# EAGLE design meaga relay v2 (EAGLE 9.6.2)
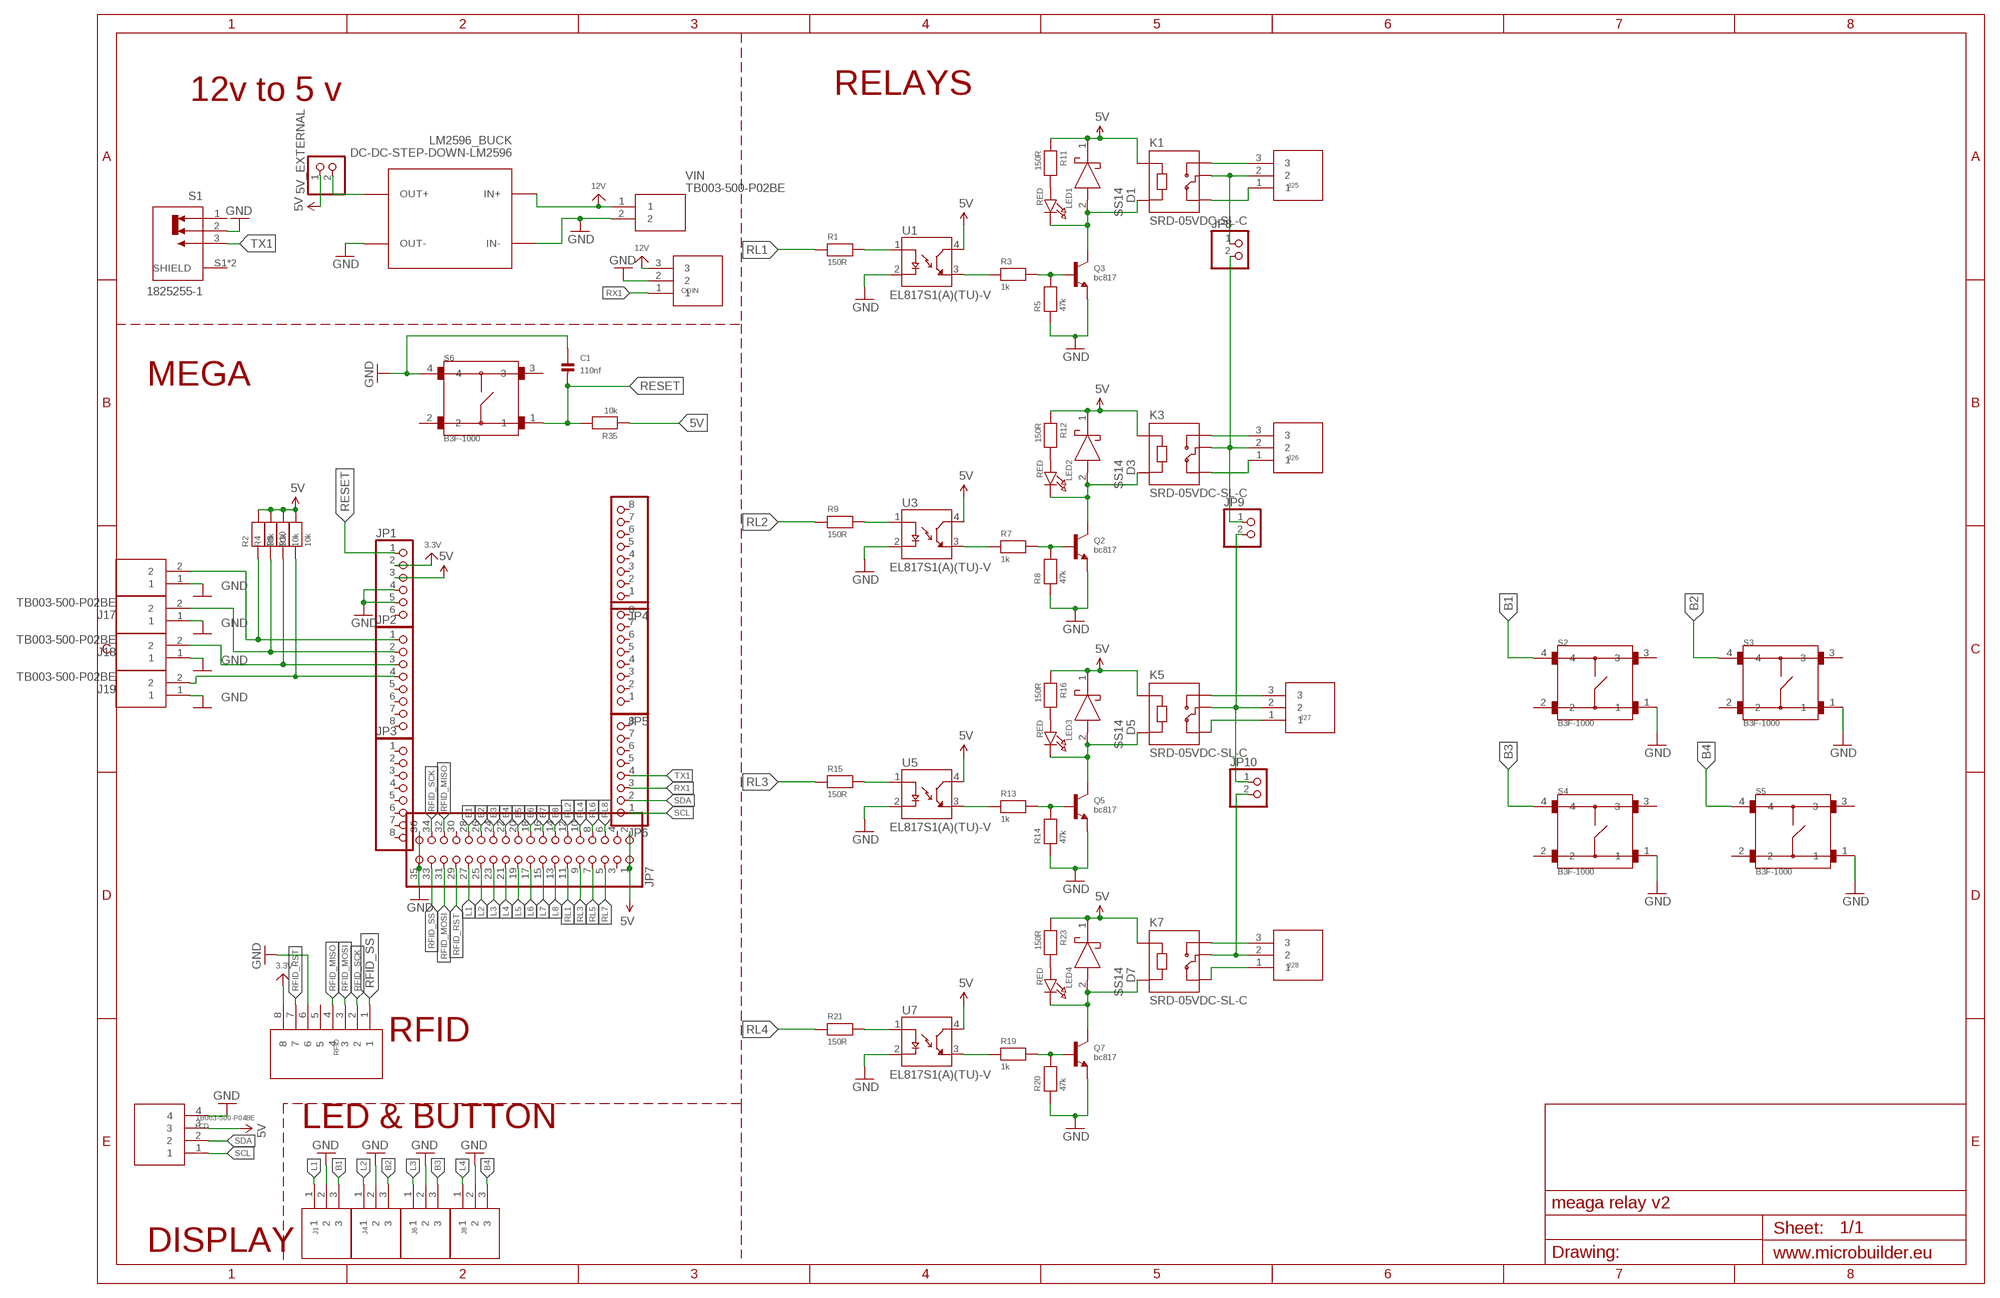
[diagram p0: schematic, sheet 1]

## Parts
5V_EXTERNAL  HEADER-1X2ROUND  [1X02_ROUND]
C1  110nf  CAP_CERAMIC0603  [0603]
COIN  TB003-500-P03BE  [CUI_TB003-500-P03BE]
D1  SS14  [DIOM5227X270N]
D3  SS14  [DIOM5227X270N]
D5  SS14  [DIOM5227X270N]
D7  SS14  [DIOM5227X270N]
J1  TB003-500-P03BE  [CUI_TB003-500-P03BE]
J4  TB003-500-P03BE  [CUI_TB003-500-P03BE]
J6  TB003-500-P03BE  [CUI_TB003-500-P03BE]
J8  TB003-500-P03BE  [CUI_TB003-500-P03BE]
J17  TB003-500-P02BE  [CUI_TB003-500-P02BE]
J18  TB003-500-P02BE  [CUI_TB003-500-P02BE]
J19  TB003-500-P02BE  [CUI_TB003-500-P02BE]
J20  TB003-500-P02BE  [CUI_TB003-500-P02BE]
J25  TB003-500-P03BE  [CUI_TB003-500-P03BE]
J26  TB003-500-P03BE  [CUI_TB003-500-P03BE]
J27  TB003-500-P03BE  [CUI_TB003-500-P03BE]
J28  TB003-500-P03BE  [CUI_TB003-500-P03BE]
JP1  PINHD-1X6  [1X06]
JP2  PINHD-1X8  [1X08]
JP3  PINHD-1X8  [1X08]
JP4  PINHD-1X8  [1X08]
JP5  PINHD-1X8  [1X08]
JP6  PINHD-1X8  [1X08]
JP7  PINHD-2X18  [2X18]
JP8  HEADER-1X2ROUND  [1X02_ROUND]
JP9  HEADER-1X2ROUND  [1X02_ROUND]
JP10  HEADER-1X2ROUND  [1X02_ROUND]
K1  SRD-05VDC-SL-C  [RELAY_SRD-05VDC-SL-C]
K3  SRD-05VDC-SL-C  [RELAY_SRD-05VDC-SL-C]
K5  SRD-05VDC-SL-C  [RELAY_SRD-05VDC-SL-C]
K7  SRD-05VDC-SL-C  [RELAY_SRD-05VDC-SL-C]
LCD  TB003-500-P04BE  [CUI_TB003-500-P04BE]
LED1  RED  LED0603  [CHIPLED_0603]
LED2  RED  LED0603  [CHIPLED_0603]
LED3  RED  LED0603  [CHIPLED_0603]
LED4  RED  LED0603  [CHIPLED_0603]
LM2596_BUCK  DC-DC-STEP-DOWN-LM2596  [DC-DC-STEP-DOWN-LM2596]
Q2  bc817  TRANSISTOR_NPN  [SOT23-R]
Q3  bc817  TRANSISTOR_NPN  [SOT23-R]
Q5  bc817  TRANSISTOR_NPN  [SOT23-R]
Q7  bc817  TRANSISTOR_NPN  [SOT23-R]
R1  150R  RESISTOR0603  [0603]
R2  10k  RESISTOR0603  [0603]
R3  1k  RESISTOR0603  [0603]
R4  10k  RESISTOR0603  [0603]
R5  47k  RESISTOR0603  [0603]
R6  10k  RESISTOR0603  [0603]
R7  1k  RESISTOR0603  [0603]
R8  47k  RESISTOR0603  [0603]
R9  150R  RESISTOR0603  [0603]
R10  10k  RESISTOR0603  [0603]
R11  150R  RESISTOR0402  [0402]
R12  150R  RESISTOR0402  [0402]
R13  1k  RESISTOR0603  [0603]
R14  47k  RESISTOR0603  [0603]
R15  150R  RESISTOR0603  [0603]
R16  150R  RESISTOR0402  [0402]
R19  1k  RESISTOR0603  [0603]
R20  47k  RESISTOR0603  [0603]
R21  150R  RESISTOR0603  [0603]
R23  150R  RESISTOR0402  [0402]
R35  10k  RESISTOR0402  [0402]
RFID  TB003-500-P08BE  [CUI_TB003-500-P08BE]
S1  1825255-1  [SW_1825255-1]
S2  B3F-1000  [SW_B3F-1000]
S3  B3F-1000  [SW_B3F-1000]
S4  B3F-1000  [SW_B3F-1000]
S5  B3F-1000  [SW_B3F-1000]
S6  B3F-1000  [SW_B3F-1000]
U1  EL817S1(A)(TU)-V  [SOIC254P1030X390-4N_EL817S1(A)(TU)-V]
U3  EL817S1(A)(TU)-V  [SOIC254P1030X390-4N_EL817S1(A)(TU)-V]
U5  EL817S1(A)(TU)-V  [SOIC254P1030X390-4N_EL817S1(A)(TU)-V]
U7  EL817S1(A)(TU)-V  [SOIC254P1030X390-4N_EL817S1(A)(TU)-V]
VIN  TB003-500-P02BE  [CUI_TB003-500-P02BE]

## Nets
3.3V: JP1.2 RFID.8
5V: 5V_EXTERNAL.1 D1.1(K) D3.1(K) D5.1(K) D7.1(K) JP1.3 JP7.1 JP7.2 K1.A1 K3.A1 K5.A1 K7.A1 LCD.3 R2.2 R4.2 R6.2 R10.2 R11.1 R12.1 R16.1 R23.1 R35.1 U1.4(CT) U3.4(CT) U5.4(CT) U7.4(CT)
12V: COIN.3 LM2596_BUCK.IN+ VIN.1
B1: J1.3 JP7.28 S2.4
B2: J4.3 JP7.26 S3.4
B3: J6.3 JP7.24 S4.4
B4: J8.3 JP7.22 S5.4
B5: JP7.20
B6: JP7.18
B7: JP7.16
B8: JP7.14
GND: C1.1 COIN.2 J1.2 J4.2 J6.2 J8.2 J17.1 J18.1 J19.1 J20.1 JP1.4 JP1.5 JP7.35 JP7.36 LCD.4 LM2596_BUCK.IN- LM2596_BUCK.OUT- Q2.2(E) Q3.2(E) Q5.2(E) Q7.2(E) R5.1 R8.1 R14.1 R20.1 RFID.6 S1.2 S2.1 S3.1 S4.1 S5.1 S6.4 U1.2(C) U3.2(C) U5.2(C) U7.2(C) VIN.2
L1: J1.1 JP7.27
L2: J4.1 JP7.25
L3: J6.1 JP7.23
L4: J8.1 JP7.21
L5: JP7.19
L6: JP7.17
L7: JP7.15
L8: JP7.13
N$1: R3.1 U1.3(ET)
N$2: R1.2 U1.1(A)
N$3: J25.1 K1.NC
N$4: J17.2 JP2.1 R2.1
N$5: J18.2 JP2.2 R4.1
N$6: J19.2 JP2.3 R6.1
N$7: J20.2 JP2.4 R10.1
N$8: 5V_EXTERNAL.2 LM2596_BUCK.OUT+
N$9: D1.2(A) K1.A2 LED1.C Q3.3(C)
N$10: LED1.A R11.2
N$11: D3.2(A) K3.A2 LED2.C Q2.3(C)
N$12: Q2.1(B) R7.2 R8.2
N$13: J26.3 K3.NO
N$14: R7.1 U3.3(ET)
N$15: Q3.1(B) R3.2 R5.2
N$16: R9.2 U3.1(A)
N$17: J26.1 K3.NC
N$18: J25.3 K1.NO
N$19: LED2.A R12.2
N$20: LED3.A R16.2
N$21: J27.1 K5.NC
N$22: J28.1 K7.NC
N$23: J25.2 JP8.1 K1.COM
N$24: J26.2 JP8.2 JP9.1 K3.COM
N$25: D5.2(A) K5.A2 LED3.C Q5.3(C)
N$26: Q5.1(B) R13.2 R14.2
N$27: J27.3 K5.NO
N$28: R13.1 U5.3(ET)
N$29: R15.2 U5.1(A)
N$30: LED4.A R23.2
N$35: J28.2 JP10.2 K7.COM
N$36: J27.2 JP9.2 JP10.1 K5.COM
N$37: D7.2(A) K7.A2 LED4.C Q7.3(C)
N$38: Q7.1(B) R19.2 R20.2
N$39: J28.3 K7.NO
N$40: R19.1 U7.3(ET)
N$41: R21.2 U7.1(A)
RESET: C1.2 JP1.1 R35.2 S6.1
RFID_MISO: JP7.32 RFID.4
RFID_MOSI: JP7.31 RFID.3
RFID_RST: JP7.29 RFID.7
RFID_SCK: JP7.34 RFID.2
RFID_SS: JP7.33 RFID.1
RL1: JP7.11 R1.1
RL2: JP7.12 R9.1
RL3: JP7.9 R15.1
RL4: JP7.10 R21.1
RL5: JP7.7
RL6: JP7.8
RL7: JP7.5
RL8: JP7.6
RX1: COIN.1 JP6.3
SCL: JP6.1 LCD.1
SDA: JP6.2 LCD.2
TX1: JP6.4 S1.3
Unconnected: JP1.6 JP2.5 JP2.6 JP2.7 JP2.8 JP3.1 JP3.2 JP3.3 JP3.4 JP3.5 JP3.6 JP3.7 JP3.8 JP4.1 JP4.2 JP4.3 JP4.4 JP4.5 JP4.6 JP4.7 JP4.8 JP5.1 JP5.2 JP5.3 JP5.4 JP5.5 JP5.6 JP5.7 JP5.8 JP6.5 JP6.6 JP6.7 JP6.8 JP7.3 JP7.4 JP7.30 RFID.5 S1.1 S1.S1(SHIELD) S1.S2(SHIELD) S2.2 S2.3 S3.2 S3.3 S4.2 S4.3 S5.2 S5.3 S6.2 S6.3

## Notes on the sheet
- 12v to 5 v | RELAYS
- MEGA
- RFID
- LED & BUTTON
- DISPLAY

## Library data of the parts
5V_EXTERNAL JP8-JP10 = microbuilder:HEADER-1X2: PIN HEADER
C1 = microbuilder:CAP_CERAMIC: Ceramic Capacitors 0402 - 0402 Surface Mount Capacitors 16pF 50V 5% [Digikey: 445-4899-2-ND] 18pF 50V 5% [Digikey: 490-1281-2-ND] 22pF 50V 5% [Digikey: 490-1283-2-ND] 68pF 50V 5% [Digikey: 490-1289-2-ND] 0.1uF 10V 10% [Digikey: 490-1318-2-ND] 1.0uF 6.3V 10% [Digikey: 490-1320-2-ND] 0603 - 0603 Surface Mount Capacitors 16 pF 50V 5% [Digikey: 445-5051-2-ND] 22 pF 50V [Digikey: PCC220ACVTR-ND] 33 pF 50V 5% [Digikey: 490-1415-1-ND] 56pF 50V 5% [Digikey: 490-1421-1-ND] 220pF 50V 5% [Digikey: 445-1285-1-ND] 680 pF 50V 2200 pF 50V 5% C0G [Digikey: 445-1297-1-ND] 5600 pF 100V 5% X7R [Digikey: 478-3711-1-ND] 0.1 µF 25V 10% [Digikey: PCC2277TR-ND] 0.22 µF 16V 10% X7R [Digikey: 445-1318-1-ND] 1.0 µF 25V 10% [Digikey: 445-5146-2-ND] 0603 - RF Specific 3pF 250V +/-0.1pF RF [Digikey: 712-1347-1-ND] 18 pF 250V 5% [Digikey: 478-3505-1-ND or 712-1322-1-ND] 56 pF 250V 5% C0G RF [Digikey: 490-4867-1-ND] 68 pF 250V RF [Digikey: 490-4868-1-ND] 0805 - 0805 Surface Mount Capacitors 220 pF 250V 2% RF Ceramic Capacitor [Digikey: 712-1398-1-ND] 1000 pF 50V 2% NP0 Ceramic Capacitor [Digikey: 478-3760-1-ND] 0.1 µF 25V 10% Ceramic Capacitor [Digikey: PCC1828TR-ND] 1.0 µF 16V 10% Ceramic Capacitor[Digikey: 490-1691-2-ND] 10.0 µF 10V 10% Ceramic Capacitor[Digikey: 709-1228-1-ND] 10.0 uF 16V 10% Ceramic Capacitor [Digikey: 478-5165-2-ND] 47 uF 6.3V 20% Ceramic Capacitor [Digikey: 587-1779-1-ND or 399-5506-1-ND] 1206 - 1206 Surface Mount Capacitors 47uF 10V 20% Ceramic Capacitor [Digikey: 490-5528-1-ND or 399-5508-1-ND or 445-6010-1-ND] 100uF 6.3V -20%, +80% Y5V Ceramic Capacitor (Digikey: 490-4512-1-ND, Mouser: 81-GRM31CF50J107ZE1L)
COIN J1 J4 J6 J8 J25-J28 = TB003-500-P03BE:TB003-500-P03BE: Check prices <https://pricing.snapeda.com/parts/TB003-500-P03BE/CUI%20Devices/view-part?ref=eda>; AVAILABILITY: Good; CUI_PURCHASE_URL: https://www.cuidevices.com/product/interconnect/connectors/terminal-blocks/tb003-500-series?utm_source=snapeda.com&utm_medium=referral&utm_campaign=snapedaBOM; DESCRIPTION: 2~24 Poles, Screw Type, Horizontal, 5.0 Pitch, 26~14 (AWG), Terminal Block Connector; MF: CUI Devices; MP: TB003-500-P03BE; PACKAGE: None; PRICE: None; PURCHASE-URL: https://pricing.snapeda.com/search/part/TB003-500-P03BE/?ref=eda
D1 D3 D5 D7 = SS14:SS14: 1.0 A Schottky Barrier Rectifiers Source: Datasheet <http://www.onsemi.com/pub/Collateral/SS19-D.pdf>; DESCRIPTION: 1.0 A Schottky Barrier Rectifiers; HEIGHT: 2.7mm; MANUFACTURER_NAME: ON Semiconductor; MANUFACTURER_PART_NUMBER: SS14; MOUSER_PART_NUMBER: 512-SS14; MOUSER_PRICE-STOCK: https://www.mouser.com/Search/Refine.aspx?Keyword=512-SS14; RS_PART_NUMBER: 7390467P; RS_PRICE-STOCK: http://uk.rs-online.com/web/p/products/7390467P
J17-J20 VIN = TB003-500-P02BE:TB003-500-P02BE: Check prices <https://pricing.snapeda.com/parts/TB003-500-P02BE/CUI%20Devices/view-part?ref=eda>; AVAILABILITY: Good; CUI_PURCHASE_URL: https://www.cuidevices.com/product/interconnect/connectors/terminal-blocks/tb003-500-series?utm_source=snapeda.com&utm_medium=referral&utm_campaign=snapedaBOM; DESCRIPTION: 2~24 Poles, Screw Type, Horizontal, 5.0 Pitch, 26~14 (AWG), Terminal Block Connector; MF: CUI Devices; MP: TB003-500-P02BE; PACKAGE: None; PRICE: None; PURCHASE-URL: https://pricing.snapeda.com/search/part/TB003-500-P02BE/?ref=eda
JP1 = pinhead:PINHD-1X6: PIN HEADER
JP2-JP6 = pinhead:PINHD-1X8: PIN HEADER
JP7 = pinhead:PINHD-2X18: PIN HEADER
K1 K3 K5 K7 = SRD-05VDC-SL-C:SRD-05VDC-SL-C: 5V Trigger Relay Module For Arduino And Raspberry Pi 5V Trigger Relay Module For Arduino And Raspberry Pi; AVAILABILITY: Unavailable; DESCRIPTION: 5V Trigger Relay Module For Arduino And Raspberry Pi 5V Trigger Relay Module For Arduino And Raspberry Pi; MF: Songle Relay; MP: SRD-05VDC-SL-C; PACKAGE: None; PRICE: None
LCD = TB003-500-P04BE:TB003-500-P04BE: Check prices <https://pricing.snapeda.com/parts/TB003-500-P04BE/CUI%20Devices/view-part?ref=eda>; AVAILABILITY: Good; CUI_PURCHASE_URL: https://www.cuidevices.com/product/interconnect/connectors/terminal-blocks/tb003-500-series?utm_source=snapeda.com&utm_medium=referral&utm_campaign=snapedaBOM; DESCRIPTION: 2~24 Poles, Screw Type, Horizontal, 5.0 Pitch, 26~14 (AWG), Terminal Block Connector; MF: CUI Devices; MP: TB003-500-P04BE; PACKAGE: None; PRICE: None; PURCHASE-URL: https://pricing.snapeda.com/search/part/TB003-500-P04BE/?ref=eda
LED1-LED4 = microbuilder:LED: LED 0603 - 0603 Surface Mount Package 2mA: Green LED - Low Power (3.9mcd, 2ma, 1.7Vf) - Digikey: 475-2709-2-ND Orange LED - Low Power (9.8mcd, 2ma, 1.8Vf) - Digikey: 475-1194-2-ND Red LED - Low Power (5mcd, 2ma, 1.8Vf) - Digikey: 475-1195-2-ND Yellow LED - Low Power (7mcd, 2ma, 1.8Vf) - Digikey: 475-1196-2-ND 5mA: Blue LED - Low Power (17mcd, 5ma, 2.9Vf) - Digikey: LNJ937W8CRACT-ND 0805 - 0805 Surface Mount Package 2mA: Red LED (8.8mcd, 2mA, 1.8Vf, Clear) - Low Power [Digikey: 475-2510-1-ND] Green LED (5mcd, 2mA, 1.8Vf, Clear) - Low Power [Digikey: 475-2730-1-ND] Yellow LED (11.3mcd, 2mA, 1.8Vf, Clear) - Low Power [Digikey: 475-2555-1-ND] 20mA: Red LED (104mcd, 20mA, Diffused) - LS R976 [Digikey: 475-1278-6-ND] Red LED (12mcd, 20mA, 2.0Vf, Clear) - APT2012EC [Digikey: 754-1128-1-ND] Green LED (15mcd, 20mA, 2.2Vf, Clear) - APT2012GC [Digikey: 754-1131-1-ND] Orange LED (160mcd, 20mA, 2.1Vf, Clear) - APT2012SECK [Digikey: 754-1130-1-ND] 1206 - 1206 Surface Mount Package Green LED (26mcd, 20mA, Diffused) - LG N971 [Digikey: 475-1407-6-ND] Red LED (15mcd, 20mA, Diffused) - LH N974 [Digikey: 475-1416-6-ND]
LM2596_BUCK = diy-modules:DC-DC-STEP-DOWN-LM2596: DC/DC Step-Down Regulator based on LM2596-ADJ chip LM2596 datasheet available here: http://www.ti.com/lit/ds/symlink/lm2596.pdf Click here to find device on ebay.com <http://www.ebay.com/sch/lm2596+power+regulator>
Q2 Q3 Q5 Q7 = microbuilder:TRANSISTOR_NPN: NPN Transistor Transistor (NPN) 500mA 45V - BC817 [Digikey: 568-1631-1-ND] Transistor (NPN) 500mA 45V - BC817,215 [Mouser: 771-BC817-T/R] SOT23-R - SOT23 footprint optimised for use with solder paste and reflow ovens. SOT23-W - SOT23 footprint optimised for hand-soldering (larger pads).
R1-R16 R19-R21 R23 R35 = microbuilder:RESISTOR: Resistors 0402 - 0402 Surface Mount Package 22 Ohm 1% 1/16W [Digikey: 311-22.0LRTR-ND] 33 Ohm 5% 1/16W 1.0K 5% 1/16W 1.5K 5% 1/16W 2.0K 1% 1/16W 10.0K 1% 1/16W [Digikey: 311-10.0KLRTR-ND] 10.0K 5% 1/16W [Digikey: RMCF0402JT10K0TR-ND] 12.1K 1% 1/16W [Digikey: 311-22.0LRTR-ND] 100.0K 5% 1/16W 0603 - 0603 Surface Mount Package 0 Ohm 1/10 Watt 1% Resistor 15 Ohm 1/10 Watt 1% Resistor 33 Ohm 1/10 Watt 1% Resistor 49.9 Ohm 1/10 Watt 1% Resistor 100 Ohm 1/10 Watt 1% Resistor 150 Ohm 1/10 Watt 1% Resistor 240 Ohm 1/10 Watt 1% Resistor 390 Ohm 1/10 Watt 1% Resistor 560 Ohm 1/10 Watt 1% Resistor 680 Ohm 1/10 Watt 1% Resistor 750 Ohm 1/10 Watt 1% Resistor 1.0K Ohm 1/10 Watt 1% Resistor 1.5K Ohm 1/10 Watt 1% Resistor 2.0K Ohm 1/10 Watt 1% Resistor 2.2K Ohm 1/10 Watt 1% Resistor 3.3K Ohm 1/10 Watt 1% Resistor 4.7K Ohm 1/10 Watt 1% Resistor 10.0K Ohm 1/10 Watt 1% Resistor 12.0K Ohm 1/10 Watt 1% Resistor 12.1K Ohm 1/10 Watt 1% Resistor 20.0K Ohm 1/10 Watt 1% Resistor 33.0K Ohm 1/10 Watt 1% Resistor 100.0K Ohm 1/10 Watt 1% Resistor 0805 - 0805 Surface Mount Package 0 Ohm 1/8 Watt 1% Resistor 33 Ohm 1/8 Watt 1% Resistor 100 Ohm 1/8 Watt 1% Resistor 150 Ohm 1/8 Watt 1% Resistor 200 Ohm 1/8 Watt 1% Resistor 240 Ohm 1/8 Watt 1% Resistor 330 Ohm 1/8 Watt 1% Resistor 390 Ohm 1/8 Watt 1% Resistor 470 Ohm 1/8 Watt 1% Resistor 1.0K Ohm 1/8 Watt 1% Resistor 1.5K Ohm 1/8 Watt 1% Resistor 2.0K Ohm 1/8 Watt 1% Resistor 4.7K Ohm 1/8 Watt 1% Resistor 5.1K Ohm 1/8 Watt 1% Resistor 5.6K Ohm 1/8 Watt 1% Resistor 10.0K Ohm 1/8 Watt 1% Resistor 22.0K Ohm 1/8 Watt 1% Resistor 33.0K Ohm 1/8 Watt 1% Resistor 100K Ohm 1/8 Watt 1% Resistor 1206 - 1206 Surface Mount Package 2012 - 2010 Surface Mount Package 0.11 Ohm 1/2 Watt 1% Resistor - Digikey: RHM.11UCT-ND
RFID = TB003-500-P08BE:TB003-500-P08BE: Check prices <https://pricing.snapeda.com/parts/TB003-500-P08BE/CUI%20Devices/view-part?ref=eda>; AVAILABILITY: Good; CUI_PURCHASE_URL: https://www.cuidevices.com/product/interconnect/connectors/terminal-blocks/tb003-500-series?utm_source=snapeda.com&utm_medium=referral&utm_campaign=snapedaBOM; DESCRIPTION: 2~24 Poles, Screw Type, Horizontal, 5.0 Pitch, 26~14 (AWG), Terminal Block Connector; MF: CUI Devices; MP: TB003-500-P08BE; PACKAGE: None; PRICE: None; PURCHASE-URL: https://pricing.snapeda.com/search/part/TB003-500-P08BE/?ref=eda
S1 = 1825255-1:1825255-1: Switch Slide ON None ON SPDT Top Slide 0.3A 125VAC PC Pins Thru-Hole Tray; COMMENT: 1825255-1; DESCRIPTION: Switch Slide ON None ON SPDT Top Slide 0.3A 125VAC PC Pins Thru-Hole Tray; DIGI-KEY_PART_NUMBER: 450-1567-ND; MF: TE Connectivity; MP: 1825255-1; PACKAGE: Custom Package TE Connectivity; PURCHASE-URL: https://pricing.snapeda.com/search/part/1825255-1/?ref=eda
S2-S6 = B3F-1000:B3F-1000: Switch, FLUX TIGHT MECHANICAL KEYSwitch, , 50MA@24VDC, NO GROUND TERM., FLAT PLUNG Check prices <https://pricing.snapeda.com/parts/B3F-1000/Omron/view-part?ref=eda>; AVAILABILITY: Warning; DESCRIPTION: Tactile Switch SPST-NO Top Actuated Through Hole; MF: Omron; MP: B3F-1000; PACKAGE: None; PRICE: None; PURCHASE-URL: https://pricing.snapeda.com/search/part/B3F-1000/?ref=eda
U1 U3 U5 U7 = EL817S1_A__TU_-V:EL817S1(A)(TU)-V: Optoisoltr 5kv Transistor 4-Smd; DESCRIPTION: Optoisolator Transistor Output 5000Vrms 1 Channel 4-SMD; DIGI-KEY_PART_NUMBER: EL817S1(A)(TU)-V-ND; MF: Everlight Electronics; MP: EL817S1(A)(TU)-V; PACKAGE: SMD-4 Everlight Electronics Co Ltd

## Net classes
0 default: width 0.203 mm, drill 0.406 mm, clearance 0.203 mm

## Board
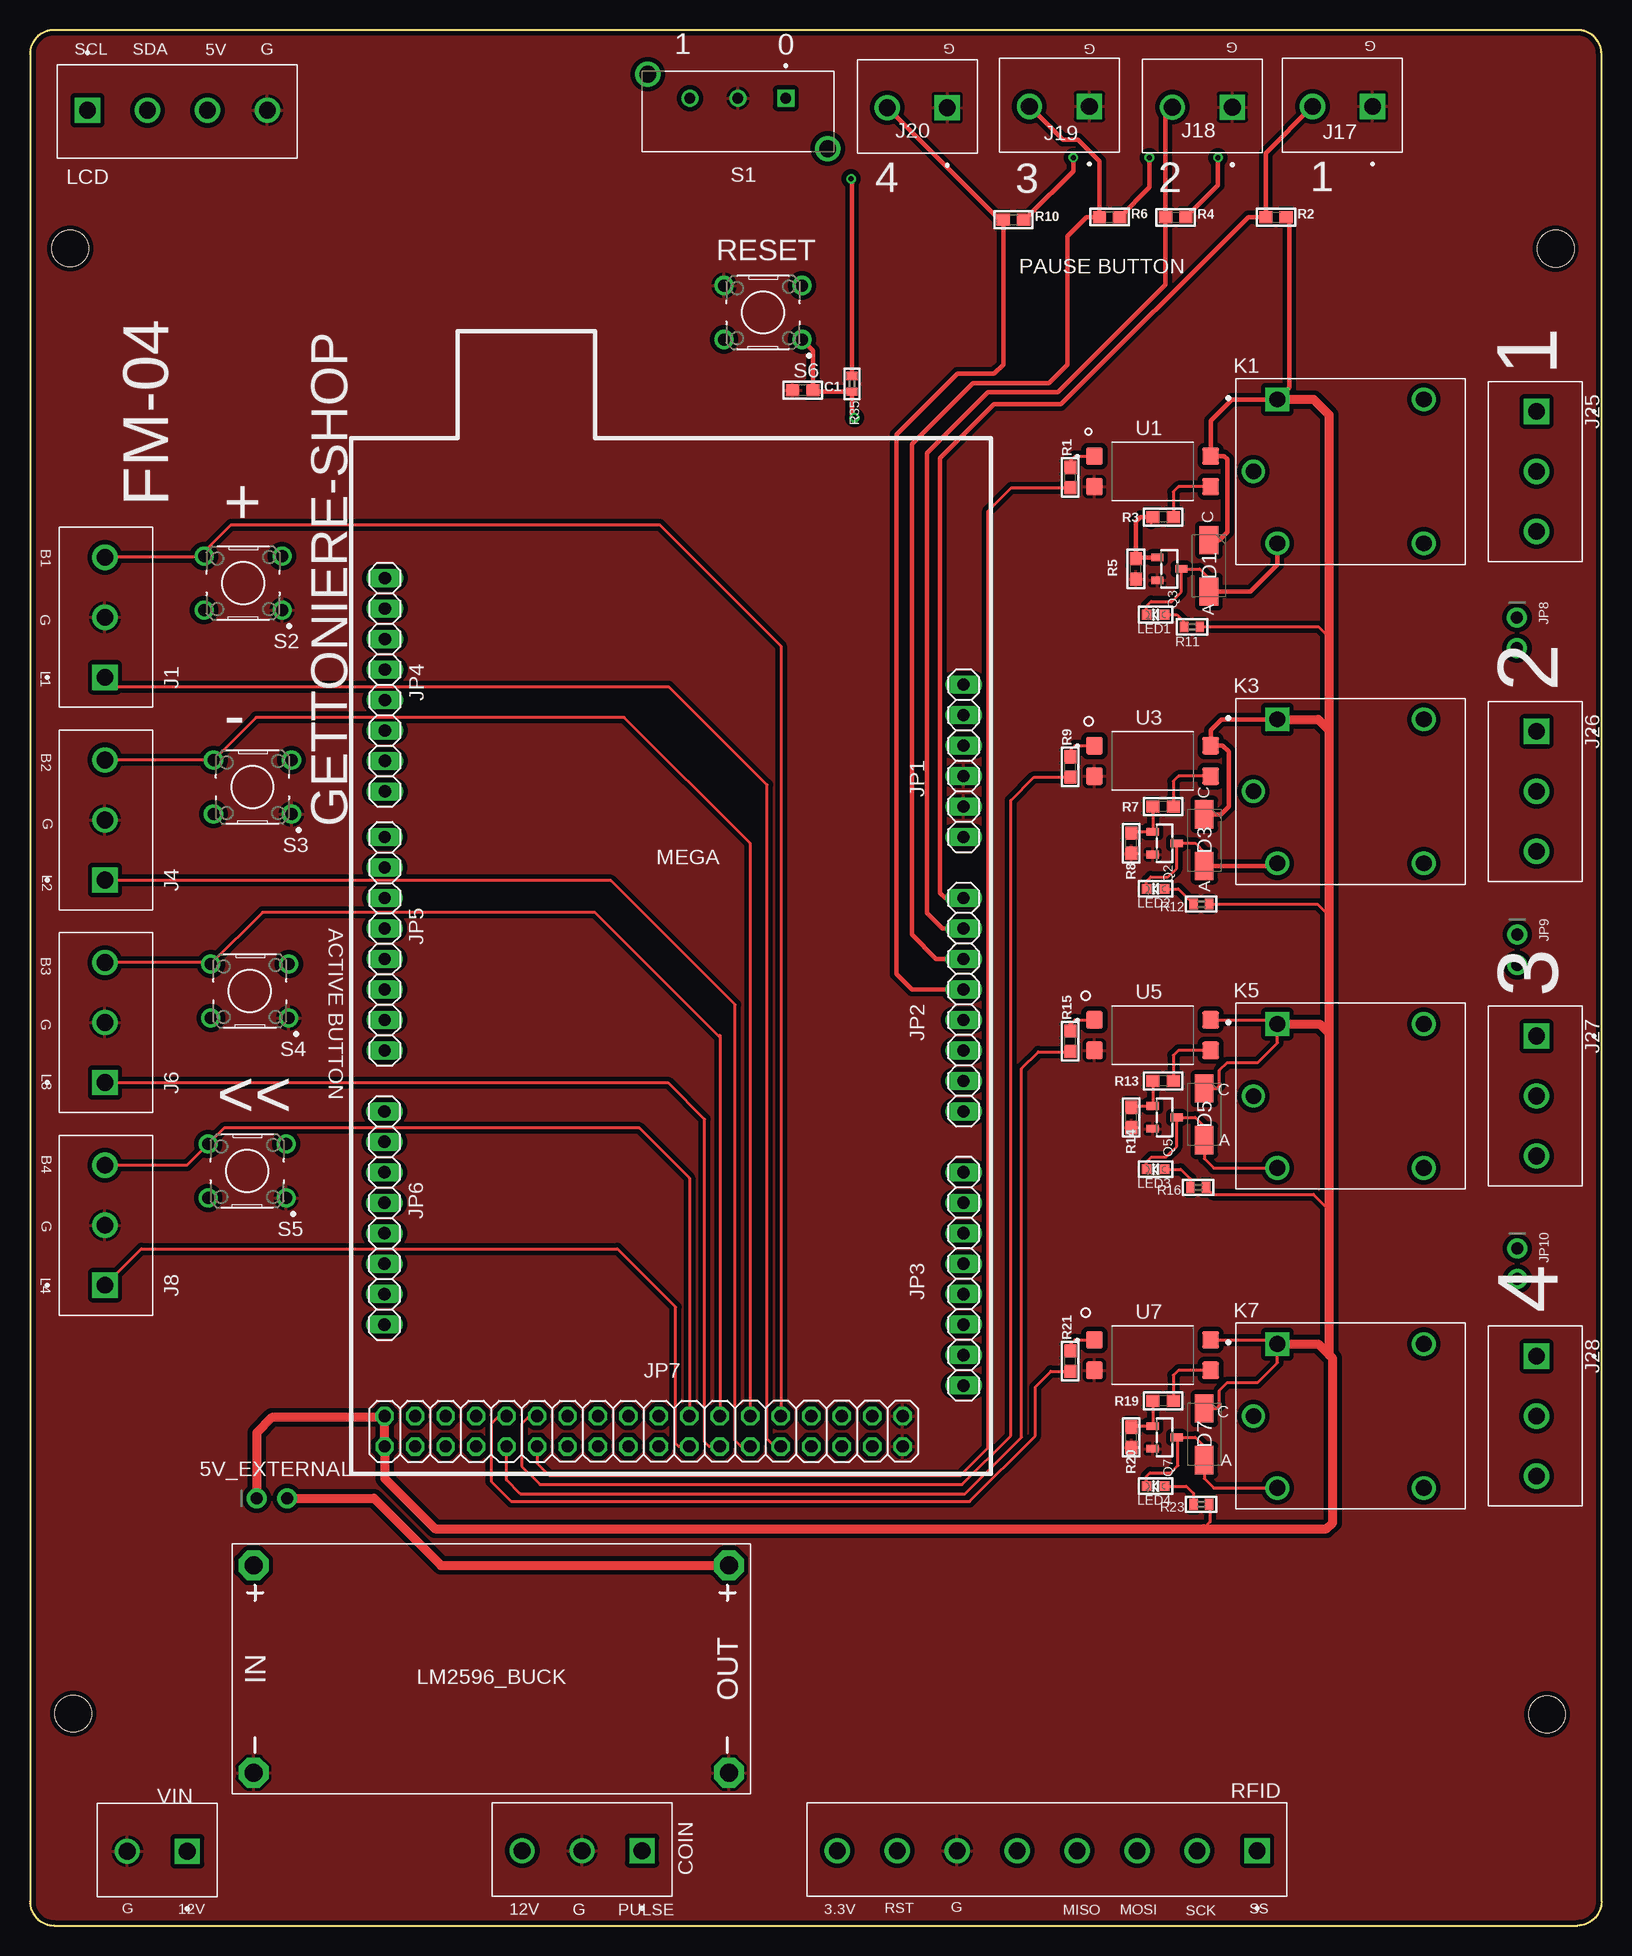
[diagram p1: board, top side]
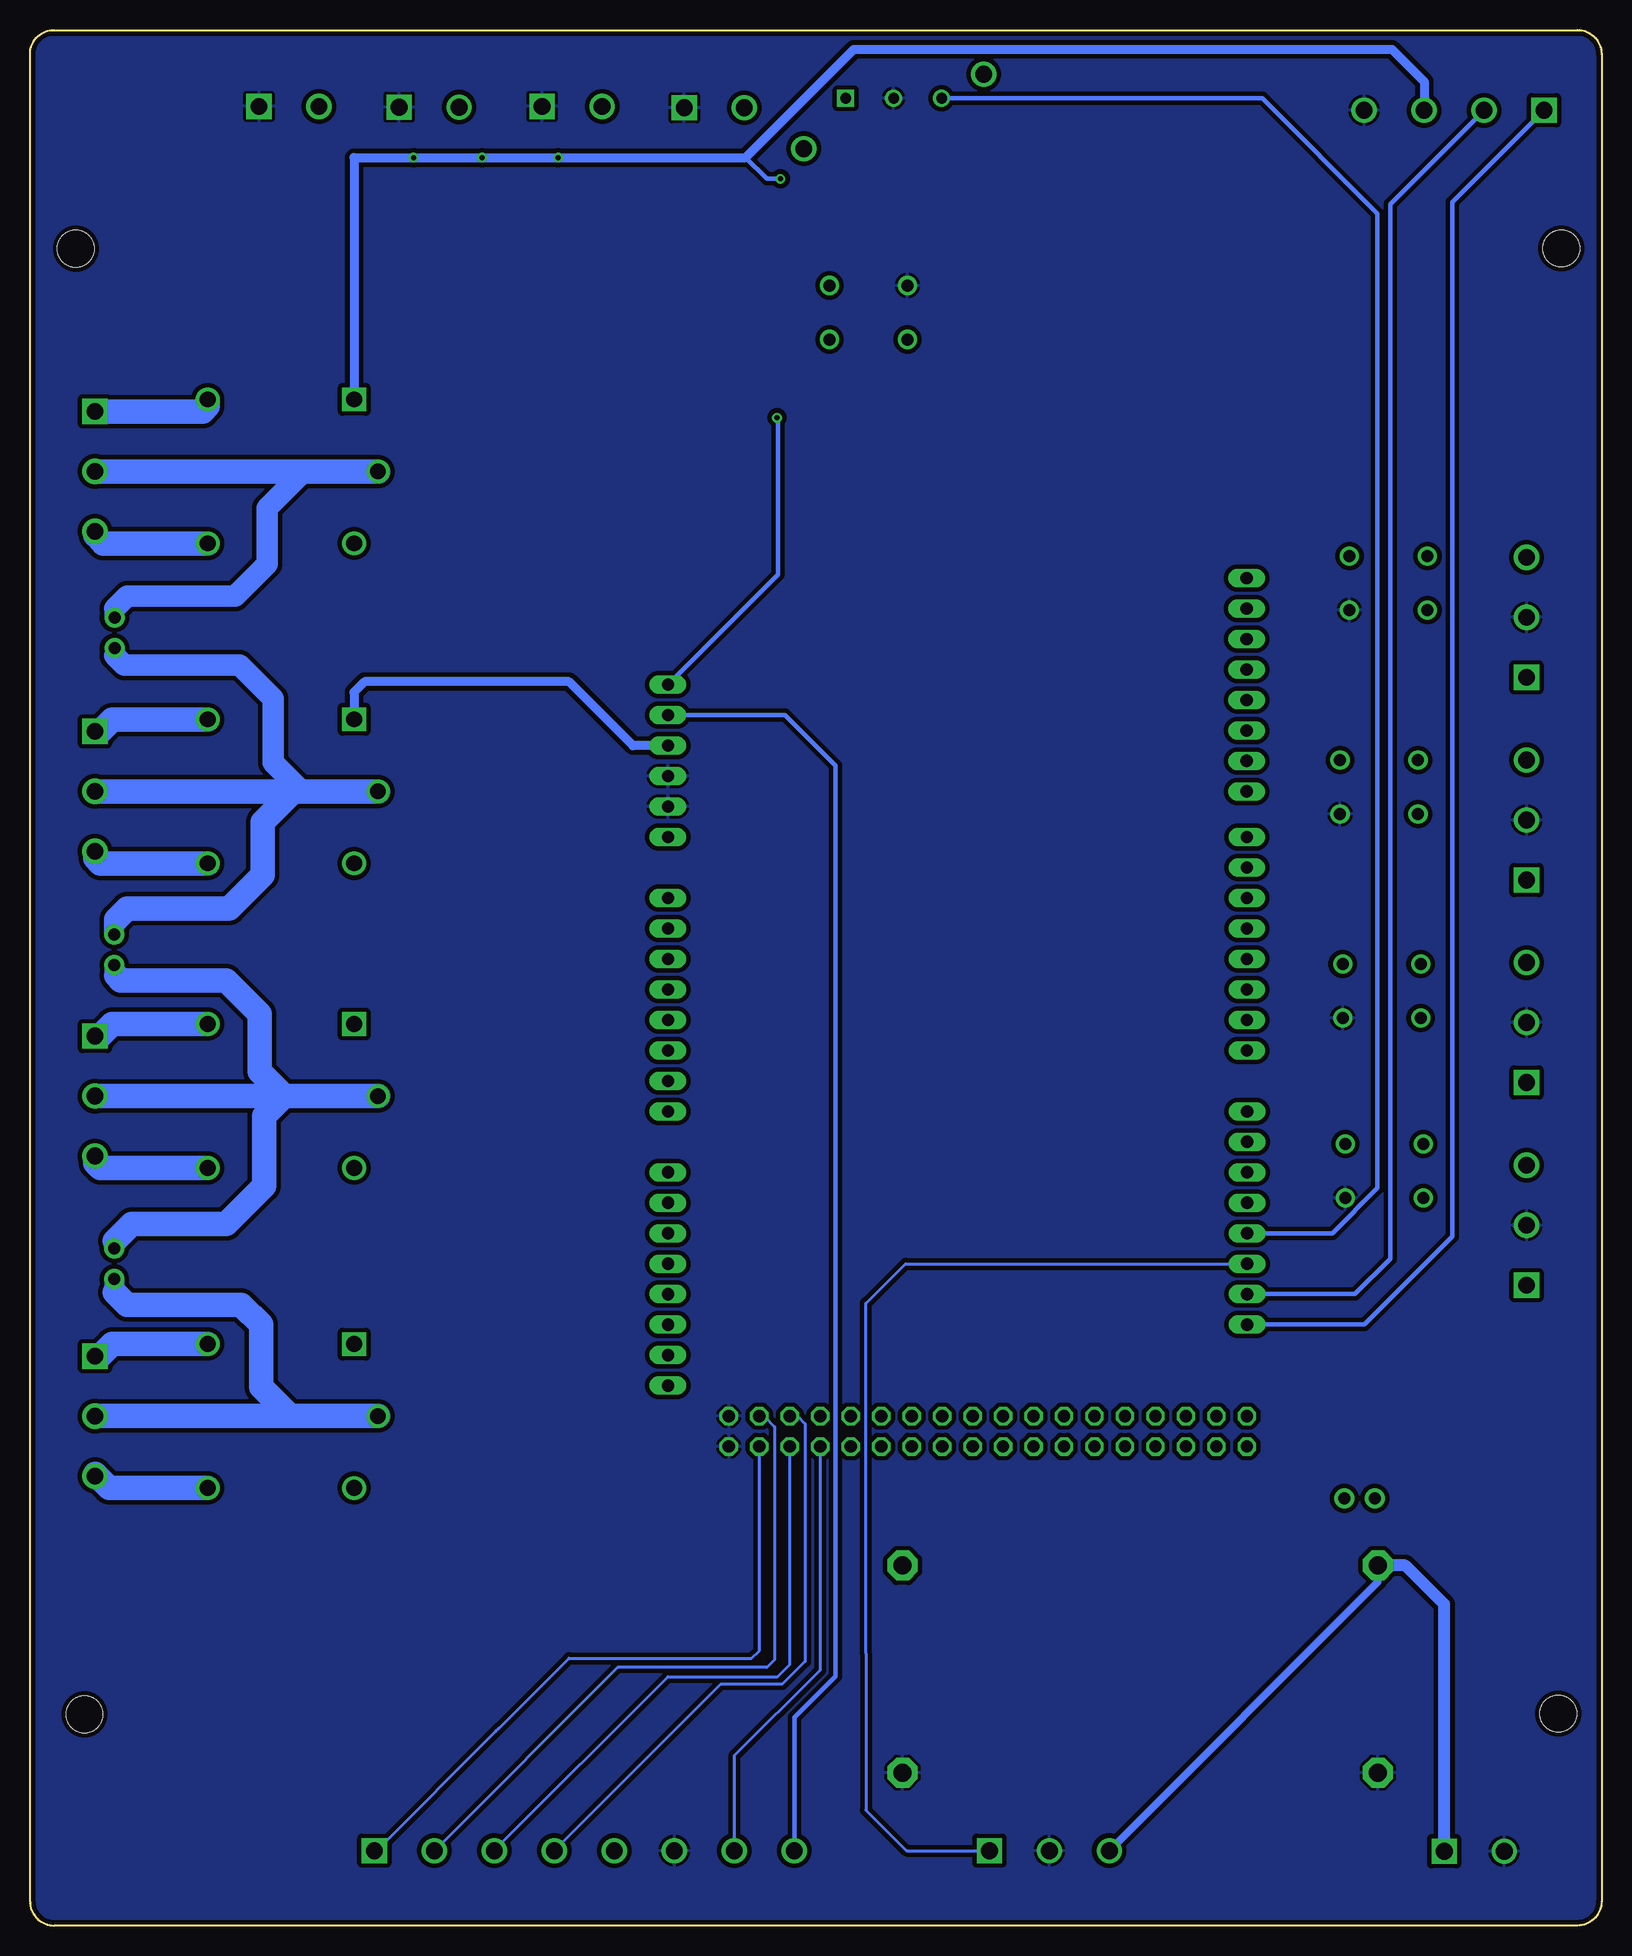
[diagram p2: board, bottom side, seen from below]

Size 131 x 158 mm. Coordinates in mm from the lower left corner, seen from the top.
Outline: 2,0 129,0 arc90 131,2 131,156 arc90 129,158 2,158 arc90 0,156 0,2 arc90 2,0
Copper layers (1*16): Top 0.035mm / dielectric 1.5mm / Bottom 0.035mm
Design rules "default *": minimum track width 6mil, minimum drill 0.3mm, track to track 6mil, track to pad 6mil, pad to pad 6mil, via to via 6mil, smd to smd 6mil, copper to edge 10mil, drill to drill 6mil, minimum pad ring 10mil, minimum via ring 8mil, stop-mask expansion 4mil, vias tented up to drill 20mil, thermal gap 10mil
Holes 3.05 mm at 126.47,17.6 127.18,139.77 3.36,139.79 3.61,17.68

### Footprints (pad centres in the part's own frame; a part is rotated, then mirrored left to right if it is on the bottom)
1X02_ROUND = drill 1 pad 1.676: 1 -1.27,0; 2 1.27,0
0603 = smd 1.1 x 1: 1 -0.85,0; 2 0.85,0
CUI_TB003-500-P03BE = drill 1.4 square: 1 0,0 | drill 1.4: 2 5,0; 3 10,0
DIOM5227X270N = smd 2.35 x 1.55: 1 -2.15,0; 2 2.15,0
CUI_TB003-500-P02BE = drill 1.4 square: 1 0,0 | drill 1.4: 2 5,0
1X06 = drill 1.016 long: 1 -6.35,0; 2 -3.81,0; 3 -1.27,0; 4 1.27,0; 5 3.81,0; 6 6.35,0
1X08 = drill 1.016 long: 1 -8.89,0; 2 -6.35,0; 3 -3.81,0; 4 -1.27,0; 5 1.27,0; 6 3.81,0; 7 6.35,0; 8 8.89,0
2X18 = drill 1.016 octagon: 1 -21.59,-1.27; 2 -21.59,1.27; 3 -19.05,-1.27; 4 -19.05,1.27; 5 -16.51,-1.27; 6 -16.51,1.27; 7 -13.97,-1.27; 8 -13.97,1.27; 9 -11.43,-1.27; 10 -11.43,1.27; 11 -8.89,-1.27; 12 -8.89,1.27; 13 -6.35,-1.27; 14 -6.35,1.27; 15 -3.81,-1.27; 16 -3.81,1.27; 17 -1.27,-1.27; 18 -1.27,1.27; 19 1.27,-1.27; 20 1.27,1.27; 21 3.81,-1.27; 22 3.81,1.27; 23 6.35,-1.27; 24 6.35,1.27; 25 8.89,-1.27; 26 8.89,1.27; 27 11.43,-1.27; 28 11.43,1.27; 29 13.97,-1.27; 30 13.97,1.27; 31 16.51,-1.27; 32 16.51,1.27; 33 19.05,-1.27; 34 19.05,1.27; 35 21.59,-1.27; 36 21.59,1.27
RELAY_SRD-05VDC-SL-C = drill 1.32 square: A1 -6.1,6 | drill 1.32: A2 -6.1,-6; NC 6.1,6; NO 6.1,-6 | drill 1.29: COM -8.1,0
CUI_TB003-500-P04BE = drill 1.4 square: 1 0,0 | drill 1.4: 2 5,0; 3 10,0; 4 15,0
CHIPLED_0603 = smd 0.8 x 0.8: A 0,-0.75; C 0,0.75
DC-DC-STEP-DOWN-LM2596 = drill 1.5 pad 2.5 octagon: IN+ -19.812,8.636; IN- -19.812,-8.636; OUT+ 19.812,8.636; OUT- 19.812,-8.636
SOT23-R = smd 0.635 x 1.016: 1 -0.95,-1; 2 0.95,-1; 3 0,1
0402 = smd 0.7 x 0.9: 1 -0.65,0; 2 0.65,0
CUI_TB003-500-P08BE = drill 1.4 square: 1 0,0 | drill 1.4: 2 5,0; 3 10,0; 4 15,0; 5 20,0; 6 25,0; 7 30,0; 8 35,0
SW_1825255-1 = drill 0.902 square: 1 -1.1,4 | drill 0.902: 2 -1.1,0; 3 -1.1,-4 | drill 1.402: S1 3.1,7.5; S2 -3.1,-7.5
SW_B3F-1000 = drill 1 pad 1.6: 1 -3.25,2.25; 2 3.25,2.25; 3 -3.25,-2.25; 4 3.25,-2.25
SOIC254P1030X390-4N_EL817S1(A)(TU)-V = smd 1.41 x 1.47: 1 -4.85,1.27; 2 -4.85,-1.27; 3 4.85,-1.27; 4 4.85,1.27

### Placement (x,y rotation side)
5V_EXTERNAL  20.17,35.61 0 top
C1  64.42,127.99 0 top
COIN  51.03,6.24 180 top
D1  98.27,113.33 270 top
D3  97.89,90.47 270 top
D5  97.89,67.61 270 top
D7  97.89,40.94 270 top
J1  6.24,104.04 90 top
J4  6.24,87.15 90 top
J6  6.24,70.26 90 top
J8  6.24,53.37 90 top
J17  111.91,151.63 180 top
J18  100.22,151.57 180 top
J19  88.31,151.63 180 top
J20  76.46,151.52 180 top
J25  125.58,126.21 270 top
J26  125.58,99.54 270 top
J27  125.58,74.14 270 top
J28  125.58,47.47 270 top
JP1  77.82,97.08 270 top
JP2  77.82,76.76 270 top
JP3  77.82,53.9 270 top
JP4  29.59,103.43 90 top
JP5  29.56,81.84 90 top
JP6  29.54,58.98 90 top
JP7  51.15,41.2 0 top
JP8  123.95,107.74 270 top
JP9  123.98,81.33 270 top
JP10  123.98,55.17 270 top
K1  110.08,121.21 0 top
K3  110.08,94.54 0 top
K5  110.08,69.14 0 top
K7  110.08,42.47 0 top
LCD  4.78,151.31 0 top
LED1  93.83,109.27 90 top
LED2  93.83,86.41 90 top
LED3  93.83,63.04 90 top
LED4  93.83,36.62 90 top
LM2596_BUCK  38.45,21.38 0 top
Q2  94.59,90.22 270 top
Q3  94.97,113.08 270 top
Q5  94.59,67.36 270 top
Q7  94.59,40.69 270 top
R1  86.71,120.7 90 top
R2  103.86,142.4 0 top
R3  94.46,117.4 180 top
R4  95.51,142.38 0 top
R5  92.17,113.08 90 top
R6  89.99,142.41 0 top
R7  94.46,93.27 180 top
R8  91.79,90.22 90 top
R9  86.71,96.57 90 top
R10  81.98,142.18 0 top
R11  96.87,108.25 180 top
R12  97.64,85.14 180 top
R13  94.46,70.41 180 top
R14  91.79,67.36 90 top
R15  86.71,73.71 90 top
R16  97.38,61.52 180 top
R19  94.46,43.74 180 top
R20  91.79,40.69 90 top
R21  86.71,47.04 90 top
R23  97.64,35.1 180 top
R35  68.52,128.5 270 top
RFID  102.28,6.24 180 top
S1  59.01,151.21 270 top
S2  17.76,111.9 180 top
S3  18.54,94.9 180 top
S4  18.32,77.9 180 top
S5  18.1,62.9 180 top
S6  61.1,134.46 180 top
U1  93.57,121.21 0 top
U3  93.57,97.08 0 top
U5  93.57,74.22 0 top
U7  93.57,47.55 0 top
VIN  13.12,6.19 180 top

### Tracks (layer width: path | path; a pad name or v marks a point on that pad's centre or on a via)
3.3V
  Bottom 0.381: JP1.2 68.05,100.89 63.85,96.69 63.85,20.77 67.28,17.34 RFID.8
5V  (via drill 0.41)
  Top 0.254: U5.4 103.63,75.49 K5.A1 103.98,73.58 102.34,71.93 99.8,71.93 99.16,71.3 99.16,70.03 98.9,69.76 D5.1 | U7.4 103.63,48.82 K7.A1 103.98,46.91 102.34,45.26 99.8,45.26 99.16,44.62 99.16,43.36 98.9,43.09 D7.1 | R11.1 107.41,108.25 108.3,107.36 | R12.1 107.31,85.14 108.3,84.15 | R16.1 98.59,60.96 106.98,60.96 108.03,59.92 108.3,59.92 | R23.1 98.37,35.01 98.37,33.63 97.81,33.07
  Top 0.381: 98.39,115.36 D1.1 99.15,115.48 99.8,116.13 99.8,122.22 99.54,122.48 U1.4 98.42,125.42 100.21,127.21 K1.A1 104.98,128.21 104.98,142.67 R2.2 | K3.A1 99.32,100.54 98.42,99.64 U3.4 99.41,98.35 99.92,97.84 99.92,93.27 99.28,92.62 D3.1 | R10.2 83.2,142.46 86.97,146.22 v86.97,147.37 | v93.32,147.37 93.32,144.89 R6.2 | R4.2 99.03,145.05 v99.03,147.37 | R35.1 68.52,145.53 v68.45,145.59
  Top 0.762: K1.A1 107,127.21 108.3,125.91 108.3,107.36 108.3,99.62 | 108.3,47.55 108.3,59.92 108.3,74.34 | 108.3,74.34 108.3,84.15 108.3,99.62 | 108.3,99.62 107.38,100.54 K3.A1 | 5V_EXTERNAL.1 18.9,41.07 20.17,42.34 29.44,42.34 JP7.2 JP7.1 29.56,37.26 33.76,33.07 97.81,33.07 108.08,33.07 108.58,33.58 108.58,47.27 108.3,47.55 | 108.3,74.34 107.51,75.14 K5.A1 | 108.3,47.55 107.38,48.47 K7.A1
  Bottom 0.381: v68.45,145.59 69.56,145.59 71.34,147.37
  Bottom 0.762: K1.A1 103.98,147.37 v99.03,147.37 v93.32,147.37 v86.97,147.37 71.34,147.37 62.33,156.38 17.47,156.38 14.78,153.69 LCD.3 | JP1.3 80.75,98.35 86.08,103.68 103.1,103.68 103.98,102.8 K3.A1
12V
  Bottom 0.635: COIN.3 18.64,28.63 LM2596_BUCK.IN+
  Bottom 1.016: VIN.1 13.12,26.78 16.36,30.02 LM2596_BUCK.IN+
B1
  Top 0.254: JP7.28 62.58,106.65 52.5,116.74 16.74,116.74 14.51,114.51 S2.4 14.41,114.04 J1.3
B2
  Top 0.254: JP7.26 60.04,90.19 49.53,100.71 18.85,100.71 S3.4 J4.3
B3
  Top 0.254: 57.5,74.22 57.5,74.04 | 57.5,74.04 JP7.24 | 57.5,74.04 47.09,84.45 19.38,84.45 S4.4 14.96,80.26 J6.3
B4
  Top 0.254: JP7.22 54.96,62.3 50.8,66.47 16.17,66.47 S5.4 13.08,63.37 J8.3
GND
  pour Top (isolate 0.381): -0.09,158.29 131.64,158.29 131.64,-0.24 -0.09,-0.24
  pour Bottom (isolate 0.381): -0.09,159.56 131.64,159.56 131.64,-0.11 -0.09,-0.11
L1
  Top 0.254: JP7.27 62.08,39.93 61.44,40.56 61.44,95.07 53.26,103.25 7.04,103.25 J1.1
L2
  Top 0.254: JP7.25 59.28,39.93 58.77,40.43 58.77,76.76 48.44,87.09 6.3,87.09 J4.1
L3
  Top 0.254: JP7.23 56.62,39.93 56.23,40.31 56.23,67.21 53.18,70.26 J6.1
L4
  Top 0.254: JP7.21 54.08,39.93 53.82,40.18 53.82,51.56 48.97,56.41 9.28,56.41 J8.1
N$1
  Top 0.254: U1.3 95.73,119.94 95.31,119.52 R3.1
N$2
  Top 0.254: R1.2 86.71,122.09 87.09,122.48 U1.1
N$3
  Bottom 2.032: J25.1 116.62,126.21 116.18,126.65 K1.NC
N$4
  Top 0.381: J17.2 103.01,147.72 R2.1 101.55,142.4 85.95,126.79 80.36,126.79 75.87,122.3 75.87,86.08 76.3,85.65 JP2.1
N$5
  Top 0.381: JP2.2 76.05,83.11 74.78,84.38 74.78,122.73 79.86,127.81 85.7,127.81 94.67,136.78 R4.1 94.67,151.02 J18.2
N$6
  Top 0.381: JP2.3 75.54,80.57 73.51,82.6 73.51,123.49 78.59,128.57 84.94,128.57 86.46,130.1 86.46,140.81 88.06,142.41 R6.1 89.14,147.08 87.37,148.84 86.09,148.84 J19.2
N$7
  Top 0.381: JP2.4 73.51,78.03 72.24,79.3 72.24,124.25 77.32,129.33 80.36,129.33 81.13,130.1 R10.1 80.81,142.18 J20.2
N$8
  Top 0.762: 5V_EXTERNAL.2 28.67,35.61 34.26,30.02 LM2596_BUCK.OUT+
N$9
  Top 0.254: D1.2 98.27,112.32 97.51,113.08 Q3.3 95.97,111.16 95.17,110.36 93.44,110.36 93.08,109.99 LED1.C
  Top 0.381: D1.2 101.71,111.18 103.98,113.45 K1.A2
N$10
  Top 0.254: LED1.A 95.6,109.27 96.22,108.65 R11.2
N$11
  Top 0.254: D3.2 97.89,89.46 97.13,90.22 Q2.3 95.59,88.12 94.87,87.4 93.42,87.4 93.08,87.06 LED2.C
  Top 0.381: D3.2 103.77,88.32 K3.A2
N$12
  Top 0.254: R8.2 91.89,91.17 Q2.1 93.61,91.19 R7.2
N$13
  Bottom 2.032: K3.NO 125.15,88.54 125.58,88.96 J26.3
N$14
  Top 0.254: U3.3 95.73,95.81 95.31,95.39 R7.1
N$15
  Top 0.254: 93.45,116.86 93.61,117.02 R3.2
  Top 0.381: R3.2 92.56,117.4 92.17,117.02 R5.2 92.28,114.03 Q3.1
N$16
  Top 0.254: R9.2 86.71,97.97 87.09,98.35 U3.1
N$17
  Bottom 2.032: K3.NC 124.15,100.54 125.15,99.54 J26.1
N$18
  Bottom 2.032: K1.NO 124.88,115.21 125.58,115.9 J25.3
N$19
  Top 0.254: LED2.A 95.72,86.41 R12.2
N$20
  Top 0.254: LED3.A 95.93,63.04 96.73,62.24 R16.2
N$21
  Bottom 2.032: K5.NC 124.15,75.14 125.15,74.14 J27.1
N$22
  Bottom 2.032: K7.NC 124.15,48.47 125.15,47.47 J28.1
N$23
  Bottom 1.651: JP8.1 123.95,109.75
  Bottom 1.778: 108.18,121.21 111.22,118.16 111.22,113.46 113.89,110.79 122.91,110.79 123.95,109.75
  Bottom 2.032: K1.COM 108.18,121.21 J25.2
N$24
  Bottom 1.651: JP8.2 123.95,105.86 | JP9.1 123.98,83.69 123.8,83.87
  Bottom 1.778: 108.05,94.54 108.3,94.54 110.72,96.95 110.72,102.28 113.51,105.08 123.16,105.08 123.95,105.86
  Bottom 2.032: J26.2 109.07,94.54 | 109.07,94.54 108.05,94.54 K3.COM | 123.8,83.87 122.91,84.76 114.4,84.76 111.61,87.55 111.61,92 109.07,94.54
N$25
  Top 0.254: K5.A2 98.68,63.14 97.89,63.93 D5.2 97.89,66.6 97.13,67.36 Q5.3 95.59,64.95 94.69,64.06 93.47,64.06 93.08,63.66 LED3.C
N$26
  Top 0.254: R14.2 91.89,68.31 Q5.1 93.61,68.33 R13.2
N$27
  Bottom 2.032: K5.NO 125.15,63.14 125.58,63.56 J27.3
N$28
  Top 0.254: U5.3 95.73,72.95 95.31,72.53 R13.1
N$29
  Top 0.254: R15.2 86.71,75.1 87.09,75.49 U5.1
N$30
  Top 0.254: LED4.A 96.39,36.62 96.99,36.03 R23.2
N$35
  Bottom 1.651: JP10.2 123.98,52.8 123.92,52.75
  Bottom 2.032: J28.2 109.32,42.47 | 109.32,42.47 K7.COM | 123.92,52.75 122.91,51.74 113.38,51.74 111.73,50.09 111.73,44.88 109.32,42.47
N$36
  Bottom 1.651: JP9.2 123.98,79.35 123.8,79.17 | JP10.1 123.98,57.02 123.92,57.07
  Bottom 2.032: J27.2 109.83,69.14 | 109.83,69.14 K5.COM | 123.8,79.17 123.42,78.79 114.65,78.79 111.86,75.99 111.86,71.17 109.83,69.14 | 123.92,57.07 122.53,58.47 114.65,58.47 111.48,61.64 111.48,67.48 109.83,69.14
N$37
  Top 0.254: K7.A2 98.68,36.47 97.89,37.26 D7.2 97.89,39.93 97.13,40.69 95.71,40.69 | Q7.3 95.71,40.69 | LED4.C 93.08,37.45 93.37,37.74 95.1,37.74 95.71,38.35 95.71,40.69
N$38
  Top 0.254: R20.2 91.89,41.64 Q7.1 93.61,41.66 R19.2
N$39
  Bottom 2.032: K7.NO 124.4,36.47 125.58,37.64 J28.3
N$40
  Top 0.254: U7.3 95.73,46.28 95.31,45.86 R19.1
N$41
  Top 0.254: R21.2 86.71,48.44 87.09,48.82 U7.1
RESET  (via drill 0.41)
  Top 0.381: v68.73,125.68 68.52,125.89 R35.2 65.41,127.85 C1.2 65.27,131.29 S6.1
  Bottom 0.381: JP1.1 68.66,112.59 68.66,125.68 v68.73,125.68
RFID_MISO
  Bottom 0.254: JP7.32 67.03,42.47 66.39,41.83 66.39,22.02 68.3,20.11 73.43,20.11 RFID.4
RFID_MOSI
  Bottom 0.254: RFID.3 92.32,6.26 77.82,20.75 68.68,20.75 67.66,21.77 JP7.31
RFID_RST
  Bottom 0.254: RFID.7 72.3,6.26 72.3,14.13 65.12,21.31 JP7.29
RFID_SCK
  Bottom 0.254: JP7.34 69.82,42.47 68.93,41.58 68.93,22.15 69.57,21.51 82.02,21.51 RFID.2
RFID_SS
  Bottom 0.254: JP7.33 70.2,22.91 70.84,22.27 86.08,22.27 91.91,16.44 92.17,16.18 102.11,6.24 RFID.1
RL1
  Top 0.254: JP7.11 42.26,38.53 43.28,37.51 77.57,37.51 79.86,39.8 79.86,117.9 81.8,119.85 R1.1
RL2
  Top 0.254: JP7.12 41.63,42.47 40.99,41.83 40.99,38.28 42.52,36.75 77.7,36.75 81.76,40.81 81.76,93.77 83.7,95.72 R9.1
RL3
  Top 0.254: JP7.9 39.72,37.13 40.87,35.99 77.95,35.99 82.65,40.69 82.65,71.42 84.05,72.82 86.67,72.82 R15.1
RL4
  Top 0.254: JP7.10 39.09,42.47 38.45,41.83 38.45,37 40.1,35.35 78.33,35.35 83.79,40.81 83.79,44.88 85.1,46.19 R21.1
RL6
  Top 0.254: JP7.8 36.68,42.47
RX1
  Bottom 0.254: JP6.3 58.01,55.17 61.31,51.86 61.31,22.93 61.31,22.7 61.31,9.62 57.93,6.24 COIN.1
SCL
  Bottom 0.381: JP6.1 19.78,50.09 12.44,57.44 12.44,143.65 LCD.1
SDA
  Bottom 0.381: JP6.2 20.55,52.63 17.61,55.56 17.61,143.48 LCD.2
TX1
  Bottom 0.381: JP6.4 22.45,57.71 18.67,61.48 18.67,142.7 28.28,152.31 S1.3

### Text on the board
tPlace: 1 | 0 | 1 | 4 | 3 | 2 | RESET | 1 | + | C | A | 2 | - | C | A | 3 | C | << | A | 4 | C | A
tNames: G | G | G | G | SCL | SDA | 5V | G | PAUSE BUTTON | FM-04 | B1 | G | L1 | B2 | G | GETTONIERE-SHOP | L2 | MEGA | ACTIVE BUTTON | B3 | G | L3 | B4 | G | L4 | G | 12V | 12V | G | PULSE | 3.3V | RST | G | MISO | MOSI | SCK | SS